# Altium schematic sheet 09_RS-232_EXT.SchDoc: =TitleParameter
size A3; Address: Crete IL; Organization: ASISGUARD; Address1: Kemalpasa, Kemalpasa Cd. No:290 D:292H, 35060 Bornova/Izmir/Turkey
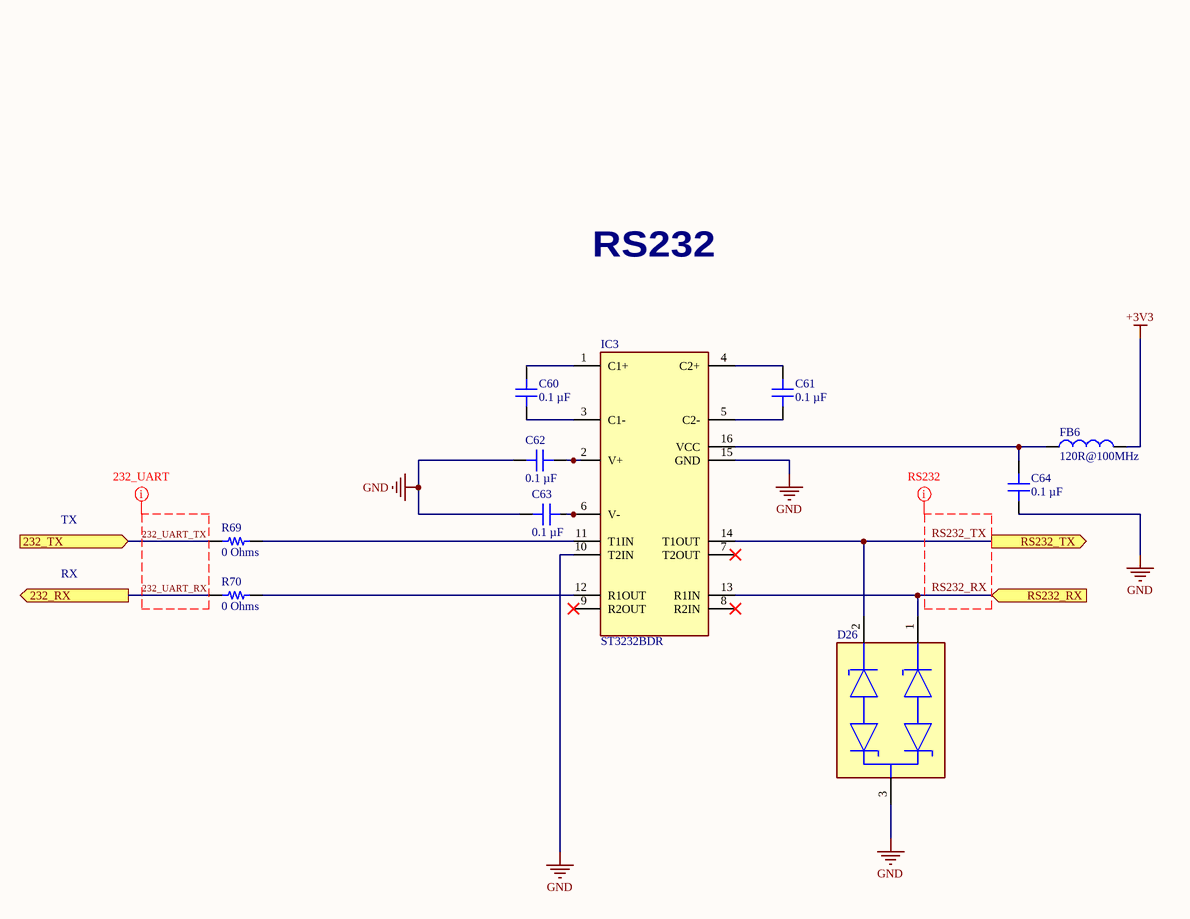
[diagram p0: 09_RS-232_EXT.SchDoc]

## Parts
C60  0.1 µF  [CAP 0805_2012]
C61  0.1 µF  [CAP 0805_2012]
C62  0.1 µF  [CAP 0805_2012]
C63  0.1 µF  [CAP 0805_2012]
C64  0.1 µF  [CAP 0805_2012]
D26  PESD12VL2BT,215  [Nexperia_SOT23_0]  (value not drawn)
FB6  value 120R@100MHz  [FB 0603(1608)]  (hidden comment: FERRITE BEAD 120 OHM 0603 1LN)
IC3  ST3232BDR  [SOIC127P600X175-16N - duplicate]
R69  0 Ohms  [RES 0402_1005]
R70  0 Ohms  [RES 0402_1005]

## Ports
232_RX (out), 232_TX (in), RS232_RX (in), RS232_TX (out)

## Nets
+3V3: FB6.2
GND: C62.2 C63.2 C64.2 D26.3(double_cathode) IC3.10(T2IN) IC3.15(GND)
232_UART_RX: R70.2 ; port 232_RX
232_UART_TX: R69.2 ; port 232_TX
RS232_RX: D26.1(cathode_1) IC3.13(R1IN) ; port RS232_RX
RS232_TX: D26.2(cathode_2) IC3.14(T1OUT) ; port RS232_TX
NetC60_1: C60.1 IC3.3(C1-)
NetC60_2: C60.2 IC3.1(C1+)
NetC61_1: C61.1 IC3.5(C2-)
NetC61_2: C61.2 IC3.4(C2+)
NetC62_1: C62.1 IC3.2(V+)
NetC63_1: C63.1 IC3.6(V-)
NetC64_1: C64.1 FB6.1 IC3.16(VCC)
NetIC3_11: IC3.11(T1IN) R69.1
NetIC3_12: IC3.12(R1OUT) R70.1

Not connected (* = marked no-connect by the designer): IC3 7(T2OUT)* 8(R2IN)* 9(R2OUT)*

## Layout directives
net class RS232: RS232_RX, RS232_TX
net class 232_UART: 232_UART_RX, 232_UART_TX

## Notes on the sheet
- RS232
- TX
- RX
- Proje/Project:
- Sayfa Adı/Document Name:
- Çizilme Tarihi/Drawing Date
- Umit KAYACIK
- Tasarlayan/Designed By
- Sayfa/Sheet:
- Revision:
- of
- Son Güncelleme/Last Edit Date
- Kontrol eden/Checked By
- Onaylayan/Approved By
- Boyut/Size:
- Varyant/Variant:
- Dil/Language:
- A3
- ENG

## Library data of the parts
C60-C64 = C2012X8R1H104K125AA: CAP CER 0.1UF 50V X8R 0805; manufacturer: TDK Corporation; Tolerance: ±10%; Part Number: C2012X8R1H104K125AA; Value: 0.1 µF; Applications: General Purpose; Capacitance: 0.1 µF; componentlink1description: Datasheet; componentlink1url: https://product.tdk.com/info/en/catalog/datasheets/mlcc_commercial_hightemp_en.pdf?ref_disty=digikey; componentlink2description: DigiKey Link; componentlink2url: https://www.digikey.com/en/products/detail/tdk-corporation/C2012X8R1H104K125AA/927140; Device Package: 0805 (2012 Metric); Features: High Temperature; lastupdated: 2/9/2024 8:15:37 PM; Lifecycle Status: Active; Minimum Order: 1; Mounting Type: Surface Mount, MLCC; Operating Temperature: -55°C ~ 150°C; Package / Case: 0805 (2012 Metric); packaging: TapeAndReel; partid: 14313; Part Status: Active; price: 0.02; series: C; Size / Dimension: 0.079" L x 0.049" W (2.00mm x 1.25mm); Supplier 1: DigiKey; Supplier Part Number 1: 445-2514-1-ND; Temperature Coefficient: X8R; Thickness (Max): 0.057" (1.45mm); Voltage - Rated: 50V
D26 = PESD12VL2BT,215: 37V Clamp 5A (8/20µs) Ipp Tvs Diode Surface Mount TO-236AB; Manufacturer: Nexperia USA Inc.; Manufacturer Part Number: PESD12VL2BT,215; Voltage - Clamping (Max) @ Ipp: 37V; Current - Peak Pulse (10/1000µs): 5A
FB6 = FB0603_120R@100MHz: 120 Ohms @ 100 MHz 1 Power Line Ferrite Bead 0603 (1608 Metric) 3A 30mOhm; Manufacturer Part Number: BLM18KG121TH1D; Order Code: Digi:490-13261-2-ND; LCSC Manufacturer Part Number: BLM18KG121TH1D; LCSC Part Number: C437404
IC3 = ST3232BDR: ST3232B Series 5.5 V 400 kbps Low Power RS-232 Drivers and Receiver - SOIC-16; Manufacturer: STMicroelectronics; Supplier 1: Digikey; Manufacturer Part Number: ST3232BDR; RoHS: Yes; Category: Interface ICs; Stock 1: 10000; Pricing 1: 2500=0.84878, 5000=0.81734, 12500=0.78591 (USD); ComponentLink1URL: https://datasheet.ciiva.com/5825/1766333-5825810.pdf?src-supplier=Farnell; ComponentLink1Description: https://datasheet.ciiva.com/5825/1766333-5825810.pdf?src-supplier=Farnell; ComponentLink2URL: https://datasheet.ciiva.com/16391/st3232bdr-16391763.pdf?src-supplier=Future+Electronics; ComponentLink2Description: https://datasheet.ciiva.com/16391/st3232bdr-16391763.pdf?src-supplier=Future+Electronics; ComponentLink3URL: https://datasheet.ciiva.com/1701/cd00002253-1701454.pdf?src-supplier=Digikey; ComponentLink3Description: https://datasheet.ciiva.com/1701/cd00002253-1701454.pdf?src-supplier=Digikey; ComponentLink4URL: https://datasheet.ciiva.com/1701/cd00002253-1701455.pdf?src-supplier=Digikey; ComponentLink4Description: https://datasheet.ciiva.com/1701/cd00002253-1701455.pdf?src-supplier=Digikey; ComponentLink5URL: https://datasheet.ciiva.com/1701/cd00002253-1701456.pdf?src-supplier=Digikey; ComponentLink5Description: https://datasheet.ciiva.com/1701/cd00002253-1701456.pdf?src-supplier=Digikey; Supplier Part Number 1: 497-6533-2-ND
R69 R70 = HCJ0402ZT0R00: RES 0 OHM JUMPER 1/8W 0402; Manufacturer: Stackpole Electronics Inc; Power (Watts): 0.125W, 1/8W; Part Number: HCJ0402ZT0R00; Value: 0 Ohms; ComponentLink1Description: Datasheet; ComponentLink1URL: https://www.seielect.com/catalog/sei-hcj.pdf; ComponentLink2Description: DigiKey Link; ComponentLink2URL: https://www.digikey.com/en/products/detail/stackpole-electronics-inc/HCJ0402ZT0R00/4357659; Composition: Metal Foil; Device Package: 0402 (1005 Metric); Features: Automotive AEC-Q200; Height - Seated (Max): 0.018" (0.45mm); LastUpdated: 2/9/2024 8:29:49 PM; Lifecycle Status: Active; Minimum Order: 1; Number of Terminations: 2; Operating Temperature: -55°C ~ 155°C; Package / Case: 0402 (1005 Metric); Packaging: TapeAndReel; PartId: 12327; Part Status: Active; Price: 0.07; Ratings: AEC-Q200; Resistance: 0 Ohms; Series: HCJ; Size / Dimension: 0.039" L x 0.020" W (1.00mm x 0.50mm); Supplier 1: DigiKey; Supplier Part Number 1: HCJ0402ZT0R00CT-ND; Supplier Device Package: 0402; Tolerance: Jumper